# EAGLE design 1x24_relayBoard_011 (EAGLE 7.5.0)
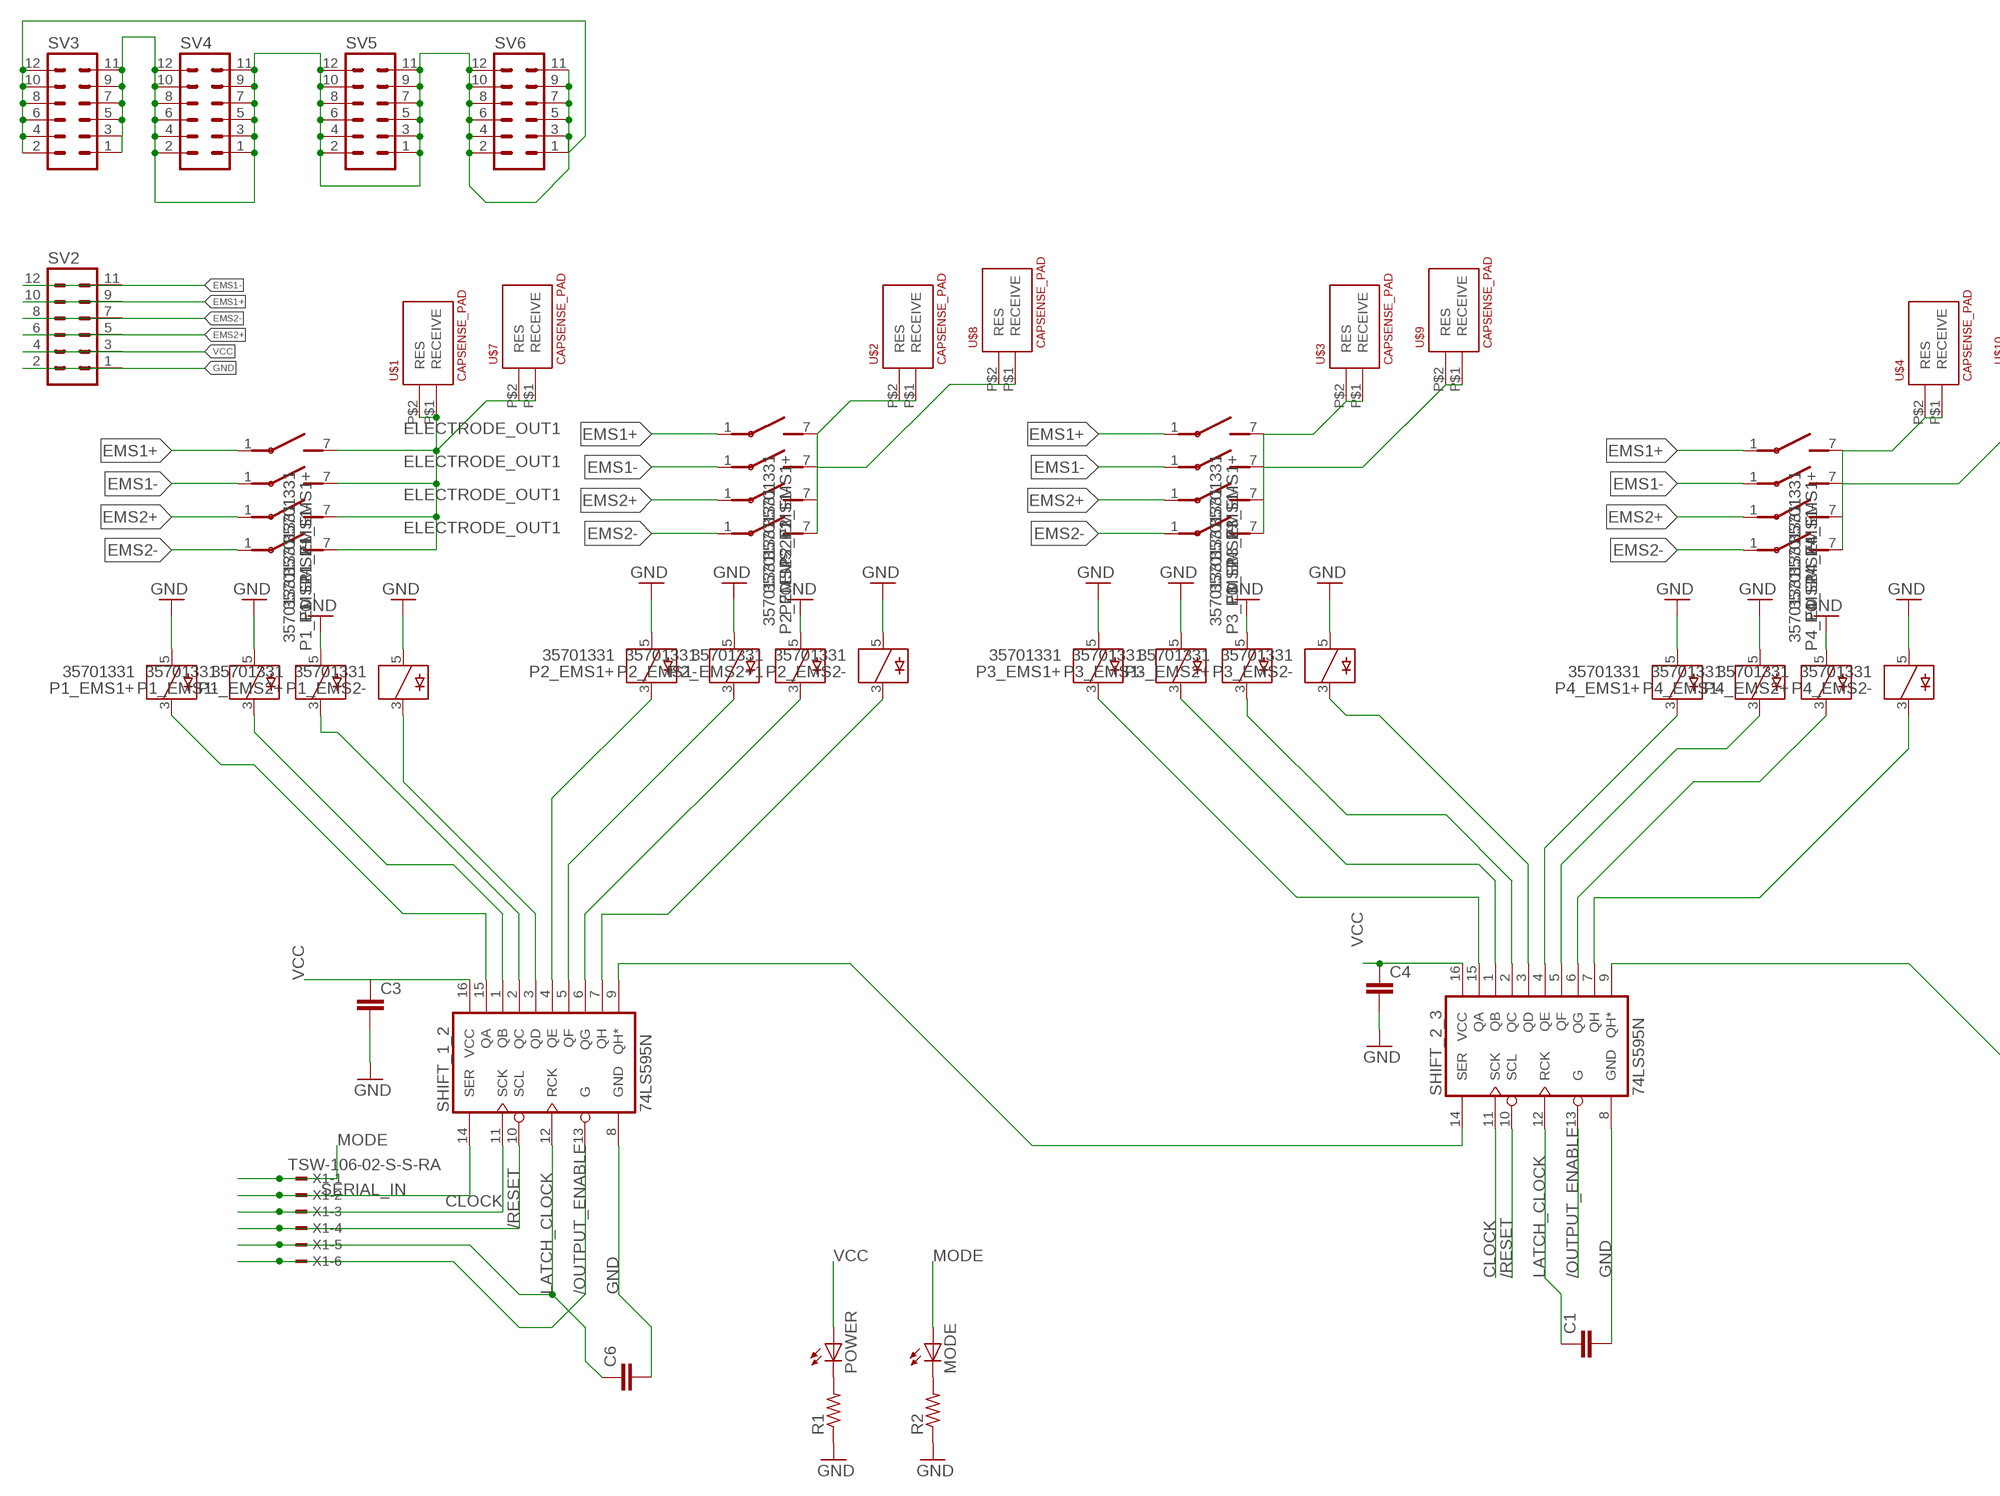
[diagram p0: schematic, sheet 1, part 1 of 2]
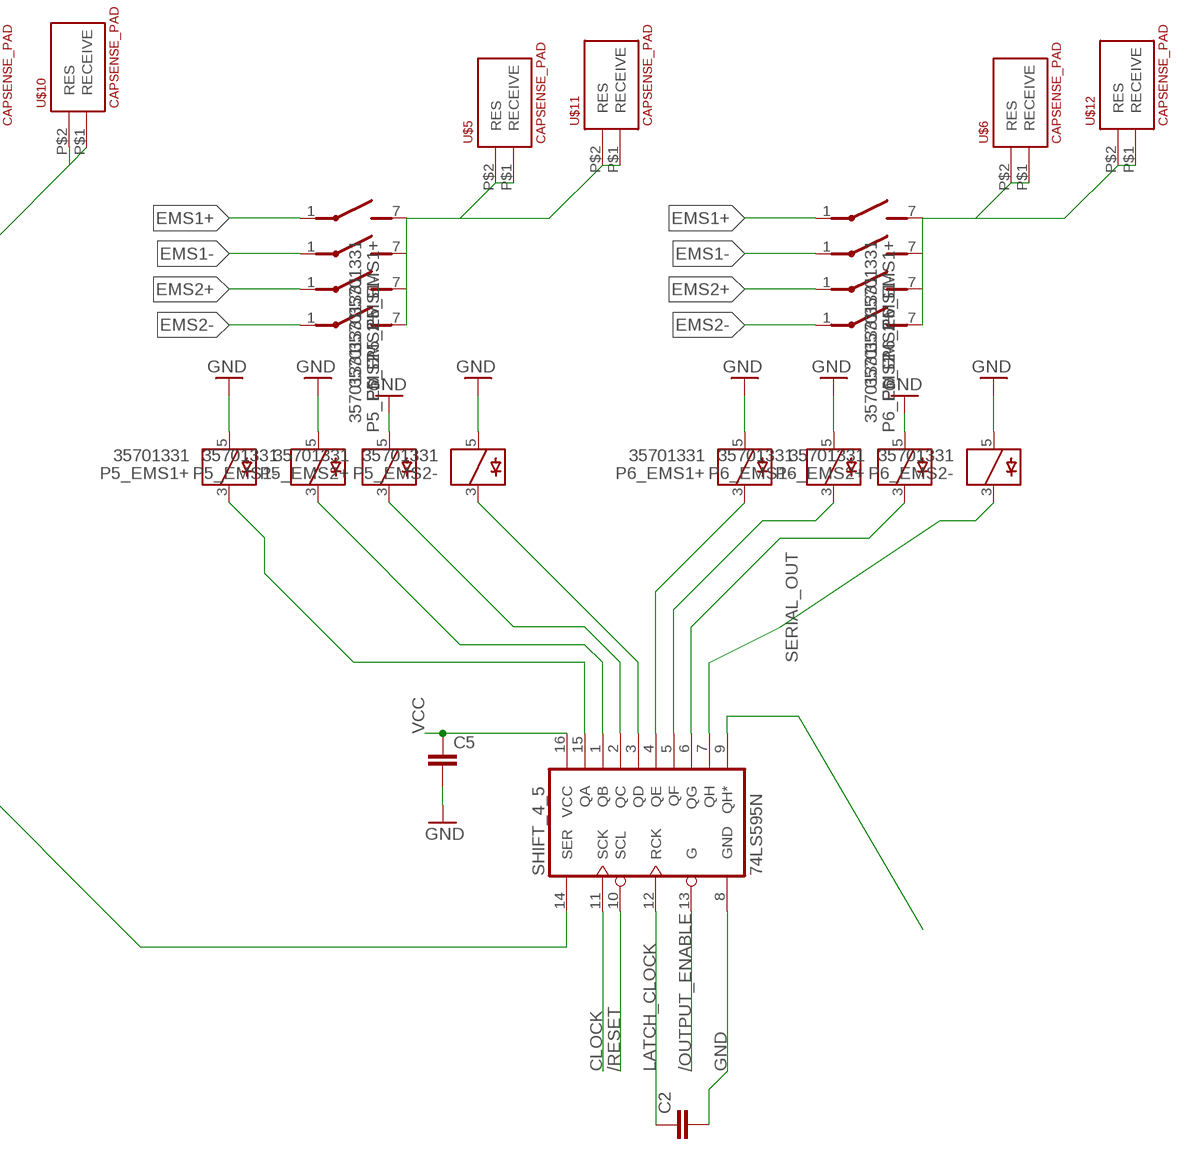
[diagram p1: schematic, sheet 1, part 2 of 2]

## Parts
C1  C5/5  [C5B5]
C2  C5/5  [C5B5]
C3  C5/5  [C5B5]
C4  C5/5  [C5B5]
C5  C5/5  [C5B5]
C6  C5/5  [C5B5]
MODE  LED_E  [LED_1206]
P1_EMS1+  35701331  [REED]
P1_EMS1-  35701331  [REED]
P1_EMS2+  35701331  [REED]
P1_EMS2-  35701331  [REED]
P2_EMS1+  35701331  [REED]
P2_EMS1-  35701331  [REED]
P2_EMS2+1  35701331  [REED]
P2_EMS2-  35701331  [REED]
P3_EMS1+  35701331  [REED]
P3_EMS1-  35701331  [REED]
P3_EMS2+  35701331  [REED]
P3_EMS2-  35701331  [REED]
P4_EMS1+  35701331  [REED]
P4_EMS1-  35701331  [REED]
P4_EMS2+  35701331  [REED]
P4_EMS2-  35701331  [REED]
P5_EMS1+  35701331  [REED]
P5_EMS1-  35701331  [REED]
P5_EMS2+  35701331  [REED]
P5_EMS2-  35701331  [REED]
P6_EMS1+  35701331  [REED]
P6_EMS1-  35701331  [REED]
P6_EMS2+  35701331  [REED]
P6_EMS2-  35701331  [REED]
POWER  LED_E  [LED_1206]
R1  R-US_M1206  [M1206]
R2  R-US_M1206  [M1206]
SHIFT_1_2  74LS595N  [DIL16]
SHIFT_2_3  74LS595N  [DIL16]
SHIFT_4_5  74LS595N  [DIL16]
SV2  MA06-2  [MA06-2]
SV3  MA06-2  [MA06-2]
SV4  MA06-2  [MA06-2]
SV5  MA06-2  [MA06-2]
SV6  MA06-2  [MA06-2]
U$1  CAPSENSE_PAD  [CAPSENSE_PAD]
U$2  CAPSENSE_PAD  [CAPSENSE_PAD]
U$3  CAPSENSE_PAD  [CAPSENSE_PAD]
U$4  CAPSENSE_PAD  [CAPSENSE_PAD]
U$5  CAPSENSE_PAD  [CAPSENSE_PAD]
U$6  CAPSENSE_PAD  [CAPSENSE_PAD]
U$7  CAPSENSE_PAD  [CAPSENSE_PAD]
U$8  CAPSENSE_PAD  [CAPSENSE_PAD]
U$9  CAPSENSE_PAD  [CAPSENSE_PAD]
U$10  CAPSENSE_PAD  [CAPSENSE_PAD]
U$11  CAPSENSE_PAD  [CAPSENSE_PAD]
U$12  CAPSENSE_PAD  [CAPSENSE_PAD]
X1  TSW-106-02-S-S-RA  [TSW-106-02-S-S-RA]

## Nets
/OUTPUT_ENABLE: SHIFT_1_2.13(G) SHIFT_2_3.13(G) SHIFT_4_5.13(G) X1.6
/RESET: SHIFT_1_2.10(SCL) SHIFT_2_3.10(SCL) SHIFT_4_5.10(SCL) X1.4
CLOCK: SHIFT_1_2.11(SCK) SHIFT_2_3.11(SCK) SHIFT_4_5.11(SCK) X1.3
ELECTRODE_OUT1: P1_EMS1+.7(2:S) P1_EMS1-.7(2:S) P1_EMS2+.7(2:S) P1_EMS2-.7(2:S) U$1.P$1(RECEIVE) U$1.P$2(RES) U$7.P$1(RECEIVE) U$7.P$2(RES)
EMS1+: P1_EMS1+.1(2:P) P2_EMS1+.1(2:P) P3_EMS1+.1(2:P) P4_EMS1+.1(2:P) P5_EMS1+.1(2:P) P6_EMS1+.1(2:P) SV2.9 SV2.10
EMS1-: P1_EMS1-.1(2:P) P2_EMS1-.1(2:P) P3_EMS1-.1(2:P) P4_EMS1-.1(2:P) P5_EMS1-.1(2:P) P6_EMS1-.1(2:P) SV2.11 SV2.12
EMS2+: P1_EMS2+.1(2:P) P2_EMS2+1.1(2:P) P3_EMS2+.1(2:P) P4_EMS2+.1(2:P) P5_EMS2+.1(2:P) P6_EMS2+.1(2:P) SV2.5 SV2.6
EMS2-: P1_EMS2-.1(2:P) P2_EMS2-.1(2:P) P3_EMS2-.1(2:P) P4_EMS2-.1(2:P) P5_EMS2-.1(2:P) P6_EMS2-.1(2:P) SV2.7 SV2.8
GND: C1.2 C2.2 C3.2 C4.2 C5.2 C6.2 P1_EMS1+.5 P1_EMS1-.5 P1_EMS2+.5 P1_EMS2-.5 P2_EMS1+.5 P2_EMS1-.5 P2_EMS2+1.5 P2_EMS2-.5 P3_EMS1+.5 P3_EMS1-.5 P3_EMS2+.5 P3_EMS2-.5 P4_EMS1+.5 P4_EMS1-.5 P4_EMS2+.5 P4_EMS2-.5 P5_EMS1+.5 P5_EMS1-.5 P5_EMS2+.5 P5_EMS2-.5 P6_EMS1+.5 P6_EMS1-.5 P6_EMS2+.5 P6_EMS2-.5 R1.1 R2.1 SHIFT_1_2.8(GND) SHIFT_2_3.8(GND) SHIFT_4_5.8(GND) SV2.1 SV2.2 SV3.1 SV3.2 SV3.3 SV3.4 SV3.5 SV3.6 SV3.7 SV3.8 SV3.9 SV3.10 SV3.11 SV3.12 SV4.1 SV4.2 SV4.3 SV4.4 SV4.5 SV4.6 SV4.7 SV4.8 SV4.9 SV4.10 SV4.11 SV4.12 SV5.1 SV5.2 SV5.3 SV5.4 SV5.5 SV5.6 SV5.7 SV5.8 SV5.9 SV5.10 SV5.11 SV5.12 SV6.1 SV6.2 SV6.3 SV6.4 SV6.5 SV6.6 SV6.7 SV6.8 SV6.9 SV6.10 SV6.11 SV6.12
LATCH_CLOCK: C1.1 C2.1 C6.1 SHIFT_1_2.12(RCK) SHIFT_2_3.12(RCK) SHIFT_4_5.12(RCK) X1.5
MODE: MODE.A X1.1
N$2: P3_EMS1+.3 SHIFT_2_3.15(QA)
N$3: P1_EMS1+.3 SHIFT_1_2.15(QA)
N$4: P1_EMS1-.3 SHIFT_1_2.1(QB)
N$5: P1_EMS2+.3 SHIFT_1_2.2(QC)
N$6: P1_EMS2-.3 SHIFT_1_2.3(QD)
N$7: P2_EMS1+.3 SHIFT_1_2.4(QE)
N$8: P2_EMS1-.3 SHIFT_1_2.5(QF)
N$9: P2_EMS2+1.3 SHIFT_1_2.6(QG)
N$10: P2_EMS2-.3 SHIFT_1_2.7(QH)
N$11: P3_EMS1-.3 SHIFT_2_3.1(QB)
N$12: P3_EMS2+.3 SHIFT_2_3.2(QC)
N$13: P3_EMS2-.3 SHIFT_2_3.3(QD)
N$14: P4_EMS1+.3 SHIFT_2_3.4(QE)
N$15: P4_EMS1-.3 SHIFT_2_3.5(QF)
N$16: P4_EMS2+.3 SHIFT_2_3.6(QG)
N$17: P4_EMS2-.3 SHIFT_2_3.7(QH)
N$18: P5_EMS1+.3 SHIFT_4_5.15(QA)
N$19: P5_EMS1-.3 SHIFT_4_5.1(QB)
N$20: P5_EMS2+.3 SHIFT_4_5.2(QC)
N$21: P5_EMS2-.3 SHIFT_4_5.3(QD)
N$22: P6_EMS1+.3 SHIFT_4_5.4(QE)
N$23: P6_EMS1-.3 SHIFT_4_5.5(QF)
N$24: P6_EMS2+.3 SHIFT_4_5.6(QG)
N$25: P6_EMS2-.3 SHIFT_4_5.7(QH)
N$26: P2_EMS1+.7(2:S) P2_EMS1-.7(2:S) P2_EMS2+1.7(2:S) P2_EMS2-.7(2:S) U$2.P$1(RECEIVE) U$2.P$2(RES) U$8.P$1(RECEIVE) U$8.P$2(RES)
N$27: P3_EMS1+.7(2:S) P3_EMS1-.7(2:S) P3_EMS2+.7(2:S) P3_EMS2-.7(2:S) U$3.P$1(RECEIVE) U$3.P$2(RES) U$9.P$1(RECEIVE) U$9.P$2(RES)
N$28: P4_EMS1+.7(2:S) P4_EMS1-.7(2:S) P4_EMS2+.7(2:S) P4_EMS2-.7(2:S) U$4.P$1(RECEIVE) U$4.P$2(RES) U$10.P$1(RECEIVE) U$10.P$2(RES)
N$29: P5_EMS1+.7(2:S) P5_EMS1-.7(2:S) P5_EMS2+.7(2:S) P5_EMS2-.7(2:S) U$5.P$1(RECEIVE) U$5.P$2(RES) U$11.P$1(RECEIVE) U$11.P$2(RES)
N$30: P6_EMS1+.7(2:S) P6_EMS1-.7(2:S) P6_EMS2+.7(2:S) P6_EMS2-.7(2:S) U$6.P$1(RECEIVE) U$6.P$2(RES) U$12.P$1(RECEIVE) U$12.P$2(RES)
N$31: SHIFT_1_2.9(QH*) SHIFT_2_3.14(SER)
N$32: SHIFT_2_3.9(QH*) SHIFT_4_5.14(SER)
N$33: POWER.C R1.2
N$34: MODE.C R2.2
SERIAL_IN: SHIFT_1_2.14(SER) X1.2
SERIAL_OUT: SHIFT_4_5.9(QH*)
VCC: C3.1 C4.1 C5.1 POWER.A SHIFT_1_2.16(VCC) SHIFT_2_3.16(VCC) SHIFT_4_5.16(VCC) SV2.3 SV2.4

## Library data of the parts
C1-C6 = capacitor-wima:C: CAPACITOR naming: grid - package width
MODE POWER = eagle-ltspice:LED_E: LED Source: http://www.osram.convergy.de Source: www.luxeon.com Source: www.kingbright.com; SPICEMODEL: NONE; SPICEPREFIX: D; SPICETYPE: diode
P1_EMS1+ P1_EMS1- P1_EMS2+ P1_EMS2- P2_EMS1+ P2_EMS1- P2_EMS2+1 P2_EMS2- P3_EMS1+ P3_EMS1- P3_EMS2+ P3_EMS2- P4_EMS1+ P4_EMS1- P4_EMS2+ P4_EMS2- P5_EMS1+ P5_EMS1- P5_EMS2+ P5_EMS2- P6_EMS1+ P6_EMS1- P6_EMS2+ P6_EMS2- = relay:35701331: RELAY reed, 1 x norm. open with polarity; OC_FARNELL: unknown; OC_NEWARK: unknown
R1 R2 = resistor:R-US_: RESISTOR, American symbol
SHIFT_1_2 SHIFT_2_3 SHIFT_4_5 = SparkFun:74*595: 8-bit SHIFT REGISTER, output latch
SV2-SV6 = con-lstb:MA06-2: PIN HEADER; OC_FARNELL: unknown; OC_NEWARK: unknown
U$1-U$12 = SparkFun-Electromechanical:CAPSENSE_PAD: Generic copper pad for a capacitive touch sensor.
X1 = con-samtec:TSW-106-02-S-S: THROUGH-HOLE .025" SQ POST HEADER Source: Samtec TSW.pdf; OC_FARNELL: unknown; OC_NEWARK: unknown

## Board
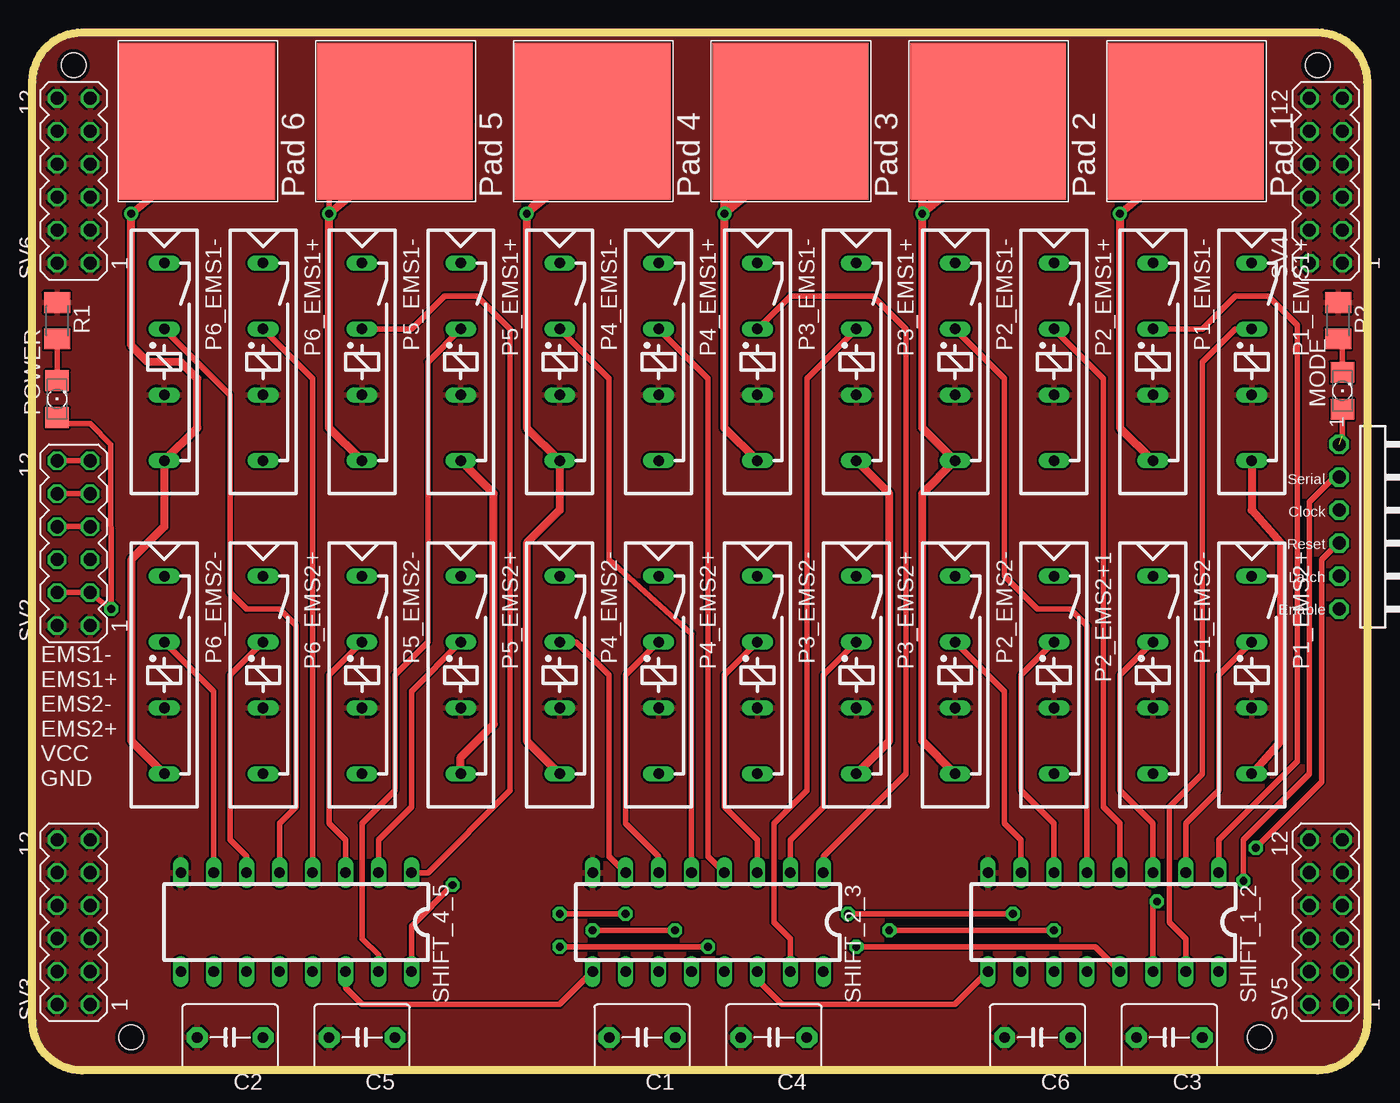
[diagram p2: board, top side]
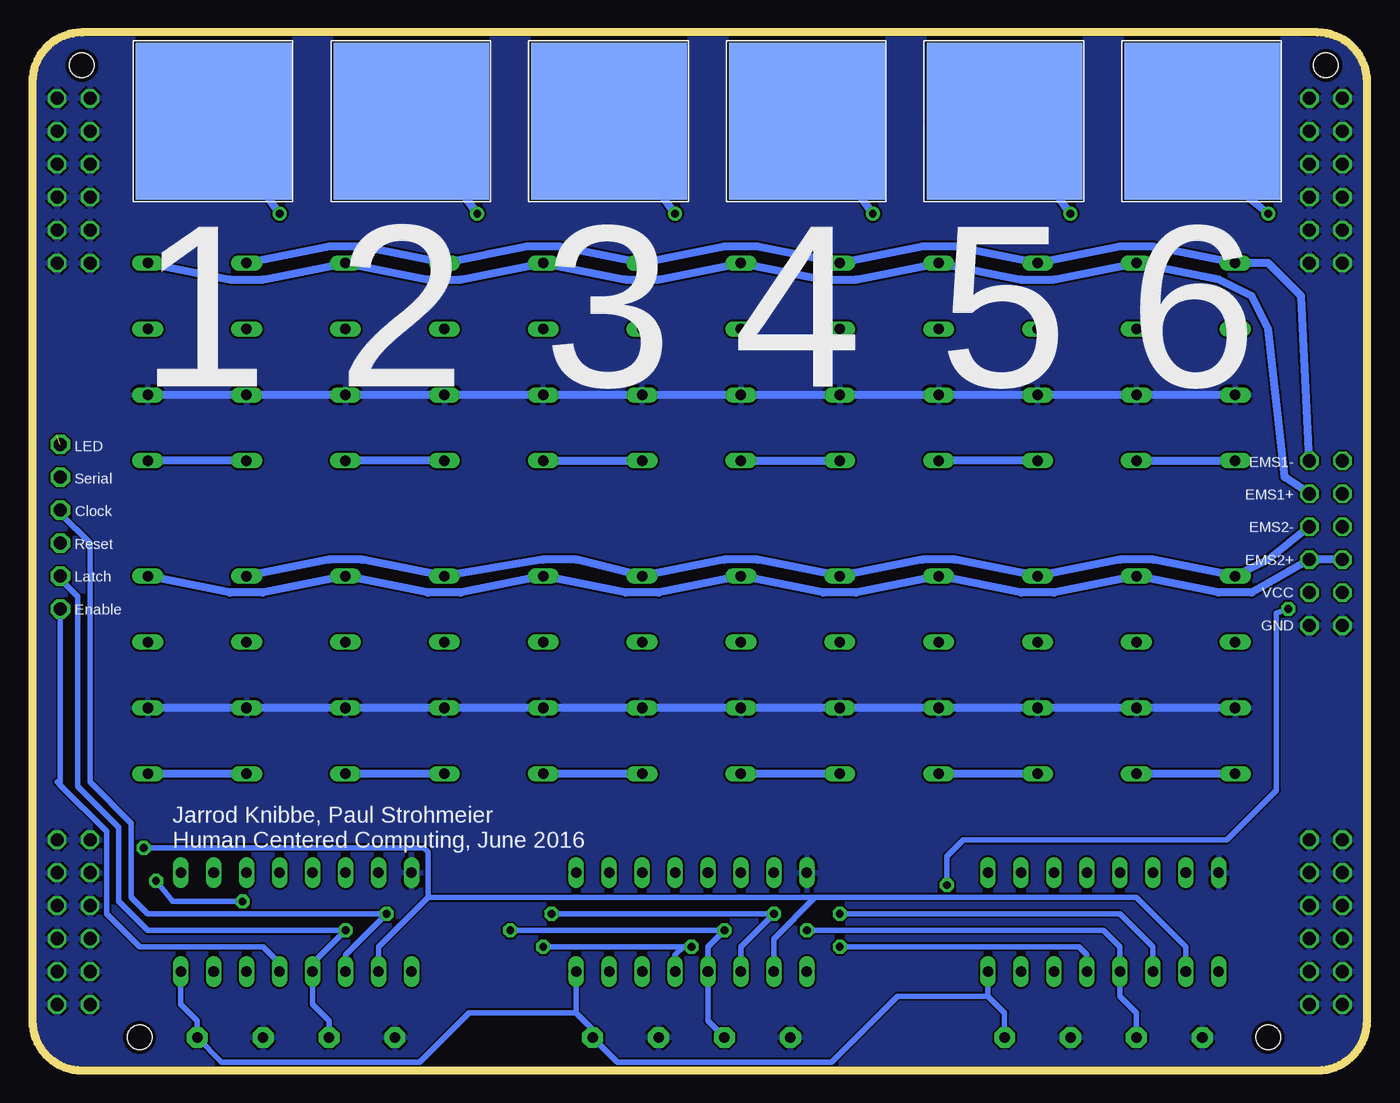
[diagram p3: board, bottom side, seen from below]

Size 102.87 x 80.01 mm. Coordinates in mm from the lower left corner, seen from the top.
Outline: 3.81,0 99.06,0 arc90 102.87,3.81 102.87,76.2 arc90 99.06,80.01 5.08,80 3.8,80 arc90 0,76.2 0,3.81 arc90 3.81,0
Copper layers (1*16): Top 0.035mm / dielectric 1.5mm / Bottom 0.035mm
Design rules "PCB-POOL Standard": minimum track width 0.15mm, minimum drill 0.3mm, track to track 0.15mm, track to pad 0.15mm, pad to pad 0.15mm, via to via 0.15mm, smd to smd 0.15mm, copper to edge 0.3mm, drill to drill 0.2mm, minimum pad ring 0.2mm, minimum via ring 0.15mm, stop-mask expansion 0.075mm, vias tented up to drill 0mil, thermal gap 0.2mm
Holes 1.91 mm at 7.62,2.54 94.61,2.54 99.06,77.47 3.17,77.47
Milling: 8 lines

### Footprints (pad centres in the part's own frame; a part is rotated, then mirrored left to right if it is on the bottom)
C5B5 = drill 0.813 pad 1.6 octagon: 1 -2.54,0; 2 2.54,0
LED_1206 = smd 1.6 x 1.803: A -1.422,0; C 1.422,0
REED = drill 0.813 long: 1 -17.78,2.54; 3 -12.7,2.54; 5 -7.62,2.54; 7 -2.54,2.54
M1206 = smd 1.6 x 2: 1 -1.4,0; 2 1.4,0
DIL16 = drill 0.813 long: 1 -8.89,-3.81; 2 -6.35,-3.81; 3 -3.81,-3.81; 4 -1.27,-3.81; 5 1.27,-3.81; 6 3.81,-3.81; 7 6.35,-3.81; 8 8.89,-3.81; 9 8.89,3.81; 10 6.35,3.81; 11 3.81,3.81; 12 1.27,3.81; 13 -1.27,3.81; 14 -3.81,3.81; 15 -6.35,3.81; 16 -8.89,3.81
MA06-2 = drill 1.016 octagon: 1 -6.35,-1.27; 2 -6.35,1.27; 3 -3.81,-1.27; 4 -3.81,1.27; 5 -1.27,-1.27; 6 -1.27,1.27; 7 1.27,-1.27; 8 1.27,1.27; 9 3.81,-1.27; 10 3.81,1.27; 11 6.35,-1.27; 12 6.35,1.27
CAPSENSE_PAD = smd 12 x 6.1: P$1 0,3; P$2 0,-3
TSW-106-02-S-S-RA = drill 1 pad 1.5 octagon: 1 6.35,1.524; 2 3.81,1.524; 3 1.27,1.524; 4 -1.27,1.524; 5 -3.81,1.524; 6 -6.35,1.524

### Placement (x,y rotation side)
C1  46.99,2.54 180 top
C2  15.24,2.54 180 top
C3  87.63,2.54 180 top
C4  57.15,2.54 180 top
C5  25.4,2.54 180 top
C6  77.47,2.54 180 top
MODE  100.97,52.39 90 top
P1_EMS1+  91.44,44.45 270 top
P1_EMS1-  83.82,44.45 270 top
P1_EMS2+  91.44,20.32 270 top
P1_EMS2-  83.82,20.32 270 top
P2_EMS1+  76.2,44.45 270 top
P2_EMS1-  68.58,44.45 270 top
P2_EMS2+1  76.2,20.32 270 top
P2_EMS2-  68.58,20.32 270 top
P3_EMS1+  60.96,44.45 270 top
P3_EMS1-  53.34,44.45 270 top
P3_EMS2+  60.96,20.32 270 top
P3_EMS2-  53.34,20.32 270 top
P4_EMS1+  45.72,44.45 270 top
P4_EMS1-  38.1,44.45 270 top
P4_EMS2+  45.72,20.32 270 top
P4_EMS2-  38.1,20.32 270 top
P5_EMS1+  30.48,44.45 270 top
P5_EMS1-  22.86,44.45 270 top
P5_EMS2+  30.48,20.32 270 top
P5_EMS2-  22.86,20.32 270 top
P6_EMS1+  15.24,44.45 270 top
P6_EMS1-  7.62,44.45 270 top
P6_EMS2+  15.24,20.32 270 top
P6_EMS2-  7.62,20.32 270 top
POWER  1.91,51.75 90 top
R1  1.91,57.78 270 top
R2  100.65,57.78 270 top
SHIFT_1_2  82.55,11.43 180 top
SHIFT_2_3  52.07,11.43 180 top
SHIFT_4_5  20.32,11.43 180 top
SV2  3.17,40.64 90 top
SV3  3.17,11.43 90 top
SV4  99.69,68.58 90 top
SV5  99.69,11.43 90 top
SV6  3.17,68.58 90 top
U$1  88.9,73.16 180 bottom
U$2  73.66,73.16 180 bottom
U$3  58.42,73.16 180 bottom
U$4  43.18,73.16 180 bottom
U$5  27.94,73.16 180 bottom
U$6  12.7,73.16 180 bottom
U$7  88.9,73.16 0 top
U$8  73.66,73.16 0 top
U$9  58.42,73.16 0 top
U$10  43.18,73.16 0 top
U$11  27.94,73.16 0 top
U$12  12.7,73.16 0 top
X1  102.23,41.91 90 top

### Tracks (layer width: path | path; a pad name or v marks a point on that pad's centre or on a via)
/OUTPUT_ENABLE  (via drill 0.6)
  Top 0.406: v40.64,9.53 v52.07,9.53 | SHIFT_1_2.13 81.92,9.53 v63.5,9.53
  Bottom 0.406: SHIFT_4_5.13 21.59,8.89 22.23,9.53 v40.64,9.53 | SHIFT_2_3.13 53.34,8.89 52.7,9.53 v52.07,9.53 v63.5,9.53 | 100.97,22.23 100.71,21.97 | 100.71,21.97 97.16,18.41 97.16,12.06 94.61,9.53 85.09,9.53 83.82,8.26 SHIFT_1_2.13 | X1.6 100.71,21.97
/RESET  (via drill 0.6)
  Top 0.406: v94.3,17.14 99.38,22.23 99.38,39.37 100.65,40.64 X1.4
  Bottom 0.406: SHIFT_4_5.10 13.97,9.53 17.78,13.34 42.55,13.34 | 42.55,13.34 45.72,10.16 SHIFT_2_3.10 | SHIFT_1_2.10 76.2,9.53 72.39,13.34 | 72.39,13.34 42.55,13.34 | 72.39,13.34 72.39,16.83 72.71,17.14 v94.3,17.14
CLOCK  (via drill 0.6)
  Top 0.406: v40.64,12.06 v45.72,12.06 | v75.56,12.06 v62.87,12.06
  Bottom 0.406: SHIFT_4_5.11 16.51,9.53 19.05,12.06 v40.64,12.06 | SHIFT_2_3.11 48.26,9.53 v45.72,12.06 v62.87,12.06 | SHIFT_1_2.11 78.74,8.89 v75.56,12.06 93.98,12.06 95.25,13.34 95.25,19.05 98.42,22.23 98.42,40.64 100.65,42.86 100.71,42.93 | 100.97,43.18 100.71,42.93 | X1.3 100.71,42.93
ELECTRODE_OUT1  (via drill 0.6)
  Top 0.406: U$7.P$1 U$7.P$2
  Top 0.61: U$7.P$2 v83.82,66.04 83.82,49.53 P1_EMS1-.7 | P1_EMS1+.7 93.98,43.18 96.2,40.64 96.2,25.4 P1_EMS2+.7
  Bottom 0.61: P1_EMS2-.7 P1_EMS2+.7 | P1_EMS1-.7 P1_EMS1+.7 | U$7.P$1 U$7.P$2 87.17,70.66 v83.82,66.04
EMS1+
  Top 0.406: SV2.9 SV2.10
  Bottom 0.61: P1_EMS1+.1 87.63,60.96 85.09,60.96 P2_EMS1+.1 72.39,60.96 69.85,60.96 P3_EMS1+.1 57.15,60.96 54.61,60.96 P4_EMS1+.1 41.91,60.96 39.37,60.96 P5_EMS1+.1 26.67,60.96 24.13,60.96 P6_EMS1+.1 11.43,60.96 8.89,59.69 7.62,57.15 6.35,45.72 SV2.9
EMS1-
  Top 0.406: SV2.12 SV2.11
  Bottom 0.61: P1_EMS1-.1 80.01,63.5 77.47,63.5 P2_EMS1-.1 64.77,63.5 62.23,63.5 P3_EMS1-.1 49.53,63.5 46.99,63.5 P4_EMS1-.1 34.29,63.5 31.75,63.5 P5_EMS1-.1 19.05,63.5 16.51,63.5 P6_EMS1-.1 7.62,62.23 5.08,59.69 SV2.11
EMS2+
  Bottom 0.61: P1_EMS2+.1 87.63,36.83 85.09,36.83 P2_EMS2+1.1 72.39,36.83 69.85,36.83 P3_EMS2+.1 57.15,36.83 54.61,36.83 P4_EMS2+.1 41.91,36.83 39.37,36.83 P5_EMS2+.1 26.67,36.83 24.13,36.83 P6_EMS2+.1 11.43,36.83 8.89,36.83 SV2.5 SV2.6
EMS2-
  Top 0.406: SV2.7 SV2.8
  Bottom 0.61: P1_EMS2-.1 80.01,39.37 77.47,39.37 P2_EMS2-.1 63.5,39.37 60.96,39.37 P3_EMS2-.1 49.53,39.37 46.99,39.37 P4_EMS2-.1 34.29,39.37 31.75,39.37 P5_EMS2-.1 19.05,39.37 16.51,39.37 P6_EMS2-.1 7.62,39.37 SV2.7
GND
  Bottom 0.61: P1_EMS1+.5 P5_EMS1-.5 P6_EMS1+.5 P6_EMS1-.5 | P6_EMS2-.5 P1_EMS2+.5
  pour Top: 3.81,0 99.06,0 arc90 102.87,3.81 102.87,76.2 arc90 99.06,80.01 3.81,80.01 arc90 0,76.2 0,3.81 arc90
  pour Bottom: 3.81,0 99.06,0 arc90 102.87,3.81 102.87,76.2 arc90 99.06,80.01 3.81,80.01 arc90 0,76.2 0,3.81 arc90
LATCH_CLOCK  (via drill 0.6)
  Top 0.406: v43.18,10.79 v49.53,10.79 | v78.74,10.79 v66.04,10.79
  Bottom 0.406: v43.18,10.79 20.32,10.79 19.05,9.53 SHIFT_4_5.12 19.05,5.71 17.78,4.45 C2.1 | v66.04,10.79 v49.53,10.79 50.8,9.53 SHIFT_2_3.12 50.8,3.81 C1.1 | C6.1 80.01,3.81 81.28,5.08 SHIFT_1_2.12 81.28,8.26 v78.74,10.79 93.98,10.79 96.2,13.02 96.2,18.73 99.38,21.91 99.38,36.51 100.65,37.78 100.97,37.78 | 100.97,37.78 101.28,37.78 | X1.5 100.71,38.04 100.97,37.78
MODE  (1 unrouted)
  Top 0.406: MODE.A 100.97,48.9
N$2
  Top 0.406: SHIFT_2_3.15 58.42,10.16 57.15,11.43 57.15,19.05 59.69,21.59 59.69,53.34 P3_EMS1+.3
N$3
  Top 0.406: SHIFT_1_2.15 88.9,10.16 87.63,11.43 87.63,20.32 90.17,22.86 90.17,54.61 92.71,57.15 P1_EMS1+.3
N$4
  Top 0.406: P1_EMS1-.3 90.17,57.15 92.71,59.69 95.25,59.69 97.47,57.47 97.47,23.81 91.44,17.78 SHIFT_1_2.1
N$5
  Top 0.406: SHIFT_1_2.2 88.9,19.05 91.44,21.59 91.44,30.48 P1_EMS2+.3
N$6
  Top 0.406: SHIFT_1_2.3 86.36,19.05 83.82,21.59 83.82,30.48 P1_EMS2-.3
N$7
  Top 0.406: SHIFT_1_2.4 83.82,19.05 82.55,20.32 82.55,53.34 P2_EMS1+.3
N$8
  Top 0.406: SHIFT_1_2.5 81.28,34.29 80.01,35.56 77.47,35.56 74.93,38.1 74.93,53.34 P2_EMS1-.3
N$9
  Top 0.406: SHIFT_1_2.6 78.74,19.05 76.2,21.59 76.2,30.48 P2_EMS2+1.3
N$10
  Top 0.406: SHIFT_1_2.7 76.2,17.78 74.93,19.05 74.93,29.21 P2_EMS2-.3
N$11
  Top 0.406: SHIFT_2_3.1 60.96,16.51 67.31,22.86 67.31,57.15 64.77,59.69 58.42,59.69 P3_EMS1-.3
N$12
  Top 0.406: SHIFT_2_3.2 58.42,17.78 60.96,20.32 60.96,30.48 P3_EMS2+.3
N$13
  Top 0.406: SHIFT_2_3.3 55.88,17.78 53.34,20.32 53.34,30.48 P3_EMS2-.3
N$14
  Top 0.406: SHIFT_2_3.4 52.07,16.51 52.07,53.34 P4_EMS1+.3
N$15
  Top 0.406: SHIFT_2_3.5 50.8,33.66 44.45,39.37 44.45,53.34 P4_EMS1-.3
N$16
  Top 0.406: SHIFT_2_3.6 48.26,16.51 45.72,19.05 45.72,30.48 P4_EMS2+.3
N$17
  Top 0.406: P4_EMS2-.3 41.91,33.02 44.45,30.48 44.45,16.51 SHIFT_2_3.7
N$18
  Top 0.406: P5_EMS1+.3 30.48,54.61 30.48,33.02 27.94,30.48 27.94,21.59 25.4,19.05 25.4,10.16 26.67,8.89 SHIFT_4_5.15
N$19
  Top 0.406: SHIFT_4_5.1 30.48,15.24 36.83,21.59 36.83,57.15 34.29,59.69 31.75,59.69 29.21,57.15 P5_EMS1-.3
N$20
  Top 0.406: SHIFT_4_5.2 26.67,17.78 29.21,20.32 29.21,29.21 P5_EMS2+.3
N$21
  Top 0.406: SHIFT_4_5.3 24.13,17.78 22.86,19.05 22.86,30.48 P5_EMS2-.3
N$22
  Top 0.406: SHIFT_4_5.4 21.59,53.34 P6_EMS1+.3
N$23
  Top 0.406: SHIFT_4_5.5 19.05,19.05 20.32,20.32 20.32,34.29 19.05,35.56 16.51,35.56 15.24,36.83 15.24,52.07 P6_EMS1-.3
N$24
  Top 0.406: SHIFT_4_5.6 16.51,16.51 15.24,17.78 15.24,30.48 P6_EMS2+.3
N$25
  Top 0.406: SHIFT_4_5.7 13.97,29.21 P6_EMS2-.3
N$26  (via drill 0.6)
  Top 0.61: P2_EMS2-.7 68.58,25.4 68.58,44.45 P2_EMS1-.7 68.58,49.53 v68.58,66.04 | v68.58,66.04 U$8.P$2 | v68.58,66.04 73.66,72.39 U$8.P$1 73.66,76.2 68.58,71.12 v68.58,66.04
  Bottom 0.61: P2_EMS1-.7 P2_EMS1+.7 | P2_EMS2-.7 P2_EMS2+1.7 | U$8.P$1 U$8.P$2 71.93,70.66 v68.58,66.04
N$27  (via drill 0.6)
  Top 0.61: P3_EMS2+.7 66.04,25.4 66.04,44.45 P3_EMS1+.7 | P3_EMS1-.7 53.34,49.53 v53.34,66.04 | v53.34,66.04 U$9.P$2 56.69,70.66 v53.34,66.04 | v53.34,66.04 53.34,71.58 U$9.P$1
  Bottom 0.61: P3_EMS2-.7 P3_EMS2+.7 | P3_EMS1+.7 P3_EMS1-.7 | U$9.P$1 U$9.P$2 56.69,70.66 v53.34,66.04
N$28  (via drill 0.6)
  Top 0.61: U$10.P$2 v38.1,66.04 | v38.1,66.04 38.1,49.53 P4_EMS1-.7 40.64,43.18 38.1,40.64 38.1,25.4 P4_EMS2-.7 | v38.1,66.04 43.18,72.39 U$10.P$1 43.18,71.12 v38.1,66.04
  Bottom 0.61: P4_EMS1+.7 P4_EMS1-.7 | P4_EMS2-.7 P4_EMS2+.7 | U$10.P$1 U$10.P$2 41.45,70.66 v38.1,66.04
N$29  (via drill 0.6)
  Top 0.406: 27.94,72.39 27.94,71.12 v22.86,66.04 22.86,67.31 27.94,72.39
  Top 0.61: P5_EMS2+.7 33.02,24.13 35.56,26.67 35.56,44.45 P5_EMS1+.7 | P5_EMS1-.7 22.86,49.53 v22.86,66.04 U$11.P$2 | U$11.P$1 27.94,72.39
  Bottom 0.61: P5_EMS1-.7 P5_EMS1+.7 | P5_EMS2-.7 P5_EMS2+.7 | U$11.P$1 U$11.P$2 26.21,70.66 v22.86,66.04
N$30  (via drill 0.6)
  Top 0.61: U$12.P$1 U$12.P$2 v7.62,66.04 7.62,55.88 8.89,54.61 11.43,54.61 12.7,53.34 12.7,49.53 P6_EMS1-.7 10.16,41.91 7.62,39.37 7.62,25.4 P6_EMS2-.7
  Bottom 0.61: P6_EMS2-.7 P6_EMS2+.7 | P6_EMS1+.7 P6_EMS1-.7 | U$12.P$1 U$12.P$2 v7.62,66.04
N$31
  Top 0.406: SHIFT_2_3.14 55.88,6.99 57.78,5.08 71.12,5.08 SHIFT_1_2.9
N$32
  Top 0.406: SHIFT_4_5.14 24.13,6.35 25.4,5.08 40.64,5.08 SHIFT_2_3.9
N$33
  Top 0.406: POWER.C R1.2
N$34
  Top 0.406: MODE.C 100.97,56.07 R2.2
SERIAL_IN  (via drill 0.6)
  Top 0.406: SHIFT_1_2.14 86.36,12.7 v86.68,13.02 | v93.34,14.61 93.34,17.78 98.42,22.86 98.42,43.81 100.01,45.4 100.33,45.72 X1.2
  Bottom 0.406: v86.68,13.02 92.08,13.02 v93.34,14.61
VCC  (via drill 0.6)
  Top 0.406: SHIFT_4_5.16 29.21,11.11 v32.38,14.29 | POWER.A 2.39,49.85 4.45,49.85 6.03,48.26 v6.08,35.58 4.45,36.78 SV2.3 SV2.4
  Bottom 0.406: C5.1 27.94,4.45 29.21,5.71 | 29.21,5.71 SHIFT_4_5.16 | 60.96,4.45 59.69,3.17 C4.1 57.78,0.64 41.27,0.64 36.2,5.71 29.21,5.71 | 60.96,4.45 SHIFT_2_3.16 | 60.96,4.45 69.22,4.45 73.03,0.64 88.27,0.64 C3.1 90.17,3.81 91.44,5.08 SHIFT_1_2.16 | v32.38,14.29 32.38,16.51 31.11,17.78 10.79,17.78 6.99,21.59 6.99,35.24 v6.08,35.58

### Text on the board
tPlace: Pad 6 | Pad 5 | Pad 4 | Pad 3 | Pad 2 | Pad 1 | Serial / Clock / Reset / Latch / Enable | EMS1- / EMS1+ / EMS2- / EMS2+ / VCC / GND
bPlace: 6 | 5 | 4 | 3 | 2 | 1 | LED / Serial / Clock / Reset / Latch / Enable | EMS1- / EMS1+ / EMS2- / EMS2+ / VCC / GND | Jarrod Knibbe, Paul Strohmeier / Human Centered Computing, June 2016
_tsilk: LED